# Altium schematic sheet IODevices.SchDoc: z80 Single Board Computer: I/O Devices
size A4; Author: Naoki Pross; DrawnBy: Naoki Pross; DocumentNumber: 3; SheetNumber: 2; SheetTotal: 4
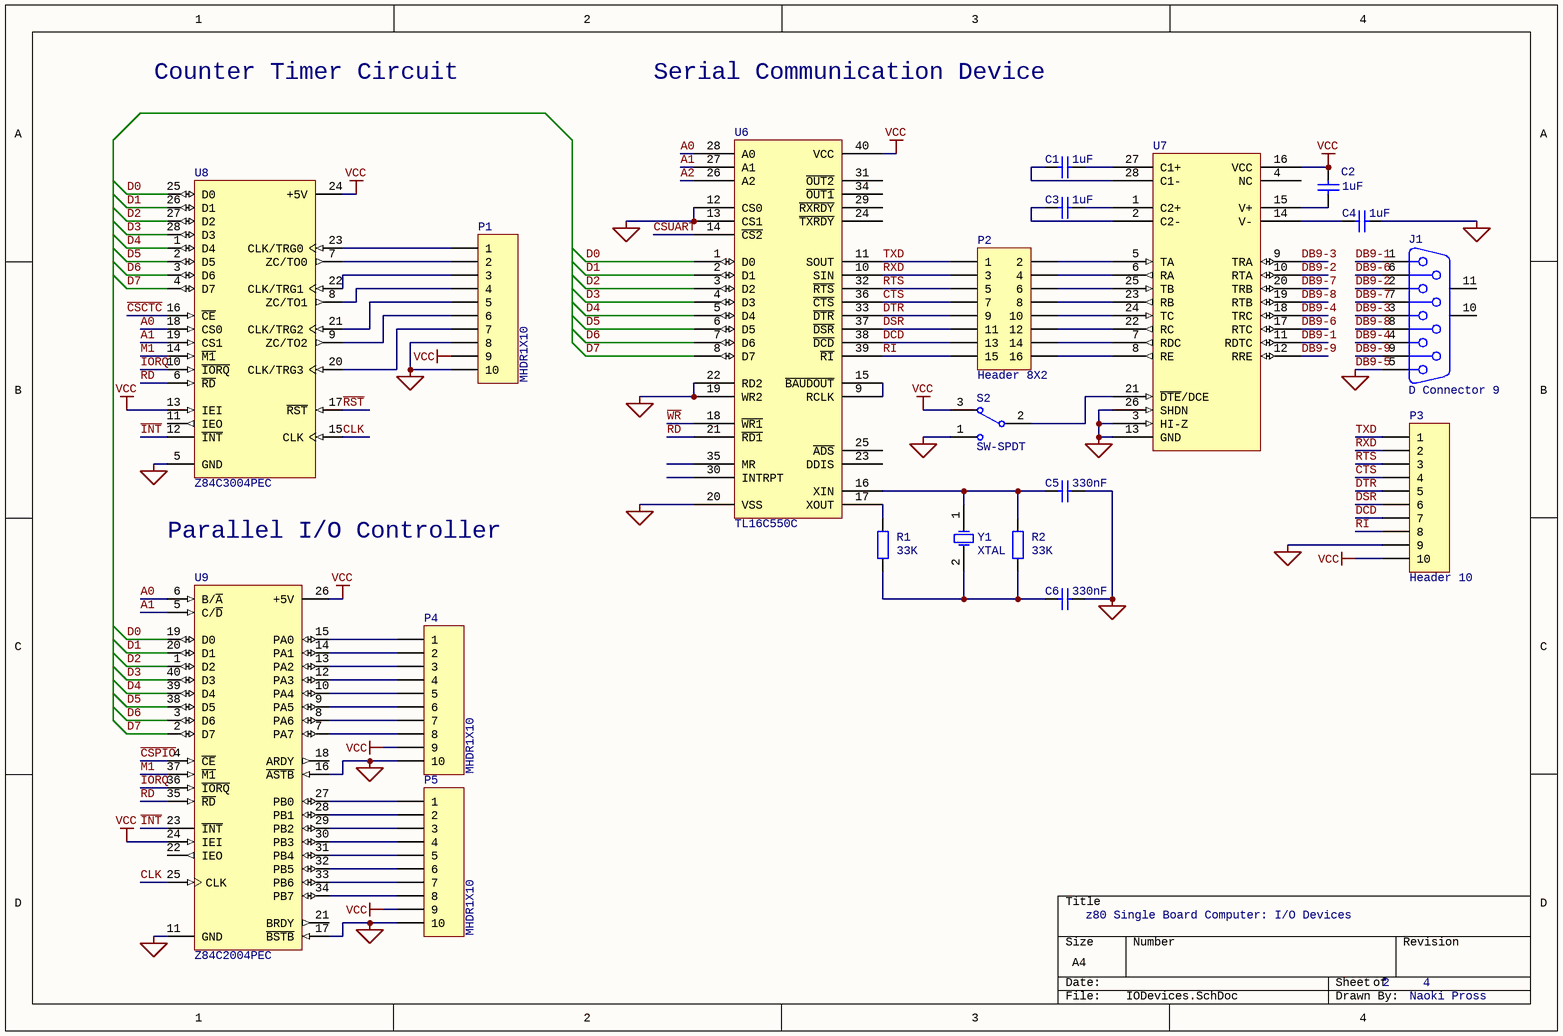
[diagram p0: IODevices.SchDoc]

## Parts
C1  value 1uF  [RAD-0.3]  (hidden comment: Cap)
C2  value 1uF  [RAD-0.3]  (hidden comment: Cap)
C3  value 1uF  [RAD-0.3]  (hidden comment: Cap)
C4  value 1uF  [RAD-0.3]  (hidden comment: Cap)
C5  value 330nF  [RAD-0.3]  (hidden comment: Cap)
C6  value 330nF  [RAD-0.3]  (hidden comment: Cap)
J1  D Connector 9  [DSUB1.385-2H9]
P1  MHDR1X10  [MHDR2X5]
P2  Header 8X2  [HDR2X8]
P3  Header 10  [MHDR2X5]
P4  MHDR1X10  [MHDR2X5]
P5  MHDR1X10  [MHDR2X5]
R1  value 33K  [AXIAL-0.4]  (hidden comment: Res2)
R2  value 33K  [AXIAL-0.4]  (hidden comment: Res2)
S2  SW-SPDT  [TL36WW15050]
U6  TL16C550C
U7  MAX214  (value not drawn)
U8  Z84C3004PEC  [PDIP28]
U9  Z84C2004PEC  [PDIP40]
Y1  XTAL  [R38]

## Nets
DB9-5: C4.2 C5.2 C6.2 J1.5 P1.8 P1.10 P3.9 P4.10 P5.10 S2.1 U6.12(CS0) U6.13(CS1) U6.19(WR2) U6.20(VSS) U6.22(RD2) U7.3(HI-Z) U7.13(GND) U7.26(SHDN) U8.5(GND) U9.11(GND) U9.16(~{ASTB}) U9.17(~{BSTB})  [also labelled GND]
VCC: C2.2 P1.9 P3.10 P4.9 P5.9 S2.3 U6.40(VCC) U7.16(VCC) U8.13(IEI) U8.24(+5V) U9.24(IEI) U9.26(+5V)
A0: U6.28(A0) U8.18(CS0) U9.6(B/~{A})
A1: U6.27(A1) U8.19(CS1) U9.5(C/~{D})
A2: U6.26(A2)
~{CSCTC}: U8.16(~{CE})
~{CSPIO}: U9.4(~{CE})
~{CSUART}: U6.14(~{CS2})
~{CTS}: P2.7 P3.4 U6.36(~{CTS})
CLK: U8.15(CLK) U9.25(CLK)
D0: U6.1(D0) U8.25(D0) U9.19(D0)
D1: U6.2(D1) U8.26(D1) U9.20(D1)
D2: U6.3(D2) U8.27(D2) U9.1(D2)
D3: U6.4(D3) U8.28(D3) U9.40(D3)
D4: U6.5(D4) U8.1(D4) U9.39(D4)
D5: U6.6(D5) U8.2(D5) U9.38(D5)
D6: U6.7(D6) U8.3(D6) U9.3(D6)
D7: U6.8(D7) U8.4(D7) U9.2(D7)
~{DCD}: P2.13 P3.7 U6.38(~{DCD})
~{DSR}: P2.11 P3.6 U6.37(~{DSR})
~{DTR}: P2.9 P3.5 U6.33(~{DTR})
DB9-1: J1.1 U7.11(RDTC)
DB9-2: J1.2 U7.10(RTA)
DB9-3: J1.3 U7.9(TRA)
DB9-4: J1.4 U7.18(TRC)
DB9-6: J1.6 U7.17(RTC)
DB9-7: J1.7 U7.20(TRB)
DB9-8: J1.8 U7.19(RTB)
DB9-9: J1.9 U7.12(RRE)
~{INT}: U8.12(~{INT}) U9.23(~{INT})
~{IORQ}: U8.10(~{IORQ}) U9.36(~{IORQ})
~{M1}: U8.14(~{M1}) U9.37(~{M1})
~{RD}: U6.21(~{RD1}) U8.6(~{RD}) U9.35(~{RD})
~{RI}: P2.15 P3.8 U6.39(~{RI})
~{RST}: U8.17(~{RST})
~{RTS}: P2.5 P3.3 U6.32(~{RTS})
RXD: P2.3 P3.2 U6.10(SIN)
TXD: P2.1 P3.1 U6.11(SOUT)
~{WR}: U6.18(~{WR1})
NetC1_1: C1.1 U7.28(C1-)
NetC1_2: C1.2 U7.27(C1+)
NetC2_1: C2.1 U7.15(V+)
NetC3_1: C3.1 U7.2(C2-)
NetC3_2: C3.2 U7.1(C2+)
NetC4_1: C4.1 U7.14(V-)
NetC5_1: C5.1 R2.2 U6.16(XIN) Y1.1(OSC1)
NetC6_1: C6.1 R1.1 R2.1 Y1.2(OSC2)
NetP1_1: P1.1 U8.23(CLK/TRG0)
NetP1_2: P1.2 U8.7(ZC/TO0)
NetP1_3: P1.3 U8.22(CLK/TRG1)
NetP1_4: P1.4 U8.8(ZC/TO1)
NetP1_5: P1.5 U8.21(CLK/TRG2)
NetP1_6: P1.6 U8.9(ZC/TO2)
NetP1_7: P1.7 U8.20(CLK/TRG3)
NetP2_2: P2.2 U7.5(TA)
NetP2_4: P2.4 U7.6(RA)
NetP2_6: P2.6 U7.25(TB)
NetP2_8: P2.8 U7.23(RB)
NetP2_10: P2.10 U7.24(TC)
NetP2_12: P2.12 U7.22(RC)
NetP2_14: P2.14 U7.7(RDC)
NetP2_16: P2.16 U7.8(RE)
NetP4_1: P4.1 U9.15(PA0)
NetP4_2: P4.2 U9.14(PA1)
NetP4_3: P4.3 U9.13(PA2)
NetP4_4: P4.4 U9.12(PA3)
NetP4_5: P4.5 U9.10(PA4)
NetP4_6: P4.6 U9.9(PA5)
NetP4_7: P4.7 U9.8(PA6)
NetP4_8: P4.8 U9.7(PA7)
NetP5_1: P5.1 U9.27(PB0)
NetP5_2: P5.2 U9.28(PB1)
NetP5_3: P5.3 U9.29(PB2)
NetP5_4: P5.4 U9.30(PB3)
NetP5_5: P5.5 U9.31(PB4)
NetP5_6: P5.6 U9.32(PB5)
NetP5_7: P5.7 U9.33(PB6)
NetP5_8: P5.8 U9.34(PB7)
NetR1_2: R1.2 U6.17(XOUT)
NetS2_2: S2.2 U7.21(~{DTE}/DCE)
NetU6_9: U6.9(RCLK) U6.15(~{BAUDOUT})

Not connected (* = marked no-connect by the designer): J1 10(MH1) 11(MH2); U6 23(DDIS) 24(~{TXRDY}) 25(~{ADS}) 29(~{RXRDY}) 30(INTRPT) 31(~{OUT2}) 34(~{OUT1}) 35(MR); U7 4(NC); U8 11(IEO); U9 18(ARDY) 21(BRDY) 22(IEO)

## Notes on the sheet
- Counter Timer Circuit
- Serial Communication Device
- Parallel I/O Controller

## Library data of the parts
C1-C6 = Cap: Capacitor; Published: 8-Jun-2000; LatestRevisionDate: 17-Jul-2002; LatestRevisionNote: Re-released for DXP Platform.; PackageReference: RAD-0.3; Publisher: Altium Limited; PackageDescription: Radial Cap, Thru-Hole; 2 Leads; 0.3 in Pin Spacing
J1 = D Connector 9: Receptacle Assembly, 9 Position, Right Angle; PackageDocument: O; Positions: 9; Published: 15-Jun-2001; LatestRevisionDate: 17-Jul-2002; LatestRevisionNote: Re-released for DXP Platform.; DatasheetDocument: 1-Sep-1999; PackageReference: 788750; Publisher: Altium Limited; Orientation: Right Angle; Gender: Receptacle
P1 P4 P5 = MHDR1X10: Header, 10-Pin; LatestRevisionDate: 17-Jul-2002; LatestRevisionNote: Re-released for DXP Platform.; Publisher: Altium Limited
P2 = Header 8X2: Header, 8-Pin, Dual row; LatestRevisionDate: 17-Jul-2002; LatestRevisionNote: Re-released for DXP Platform.; Publisher: Altium Limited
P3 = Header 10: Header, 10-Pin; LatestRevisionDate: 17-Jul-2002; LatestRevisionNote: Re-released for DXP Platform.; Publisher: Altium Limited
R1 R2 = Res2: Resistor; Published: 8-Jun-2000; LatestRevisionDate: 17-Jul-2002; LatestRevisionNote: Re-released for DXP Platform.; PackageReference: AXIAL-0.4; Publisher: Altium Limited; PackageDescription: Axial Device, Thru-Hole; 2 Leads; 0.4 in Pin Spacing
S2 = SW-SPDT: SPDT Subminiature Toggle Switch, Right Angle Mounting, Vertical Actuation; Published: 24-Mar-1999; LatestRevisionDate: 17-Dec-2003; LatestRevisionNote: Schematic revised, PCB Footprint replaced.; DatasheetVersion: 05-Dec-2000; PackageReference: TL36WW15050; Publisher: Altium Limited; PackageDescription: Switch; 4 Leads; ComponentLink1Description: Manufacturer Link; ComponentLink1URL: http://www.apem.com
U8 = Z84C3004PEC: CMOS Four-Channel Counter/Timer Circuit; Note: Pin(s) 28 "No Connection" and not drawn.; Published: 15-Apr-2002; LatestRevisionDate: 04-Mar-2005; LatestRevisionNote: Stylized 3D Model Added.; DatasheetVersion: 2001; PackageVersion: 2001; PackageReference: PDIP28; Publisher: Altium Limited; PackageDescription: DIP; 28 Leads; Row Spacing 15.24 mm; Pitch 2.54 mm; ComponentLink1Description: Manufacturer Link; ComponentLink1URL: http://www.zilog.com/; ComponentLink2Description: Datasheet; ComponentLink2URL: http://www.zilog.com/docs/z80/um0081.pdf
U9 = Z84C2004PEC: CMOS Parallel I/O Controller; Published: 15-Apr-2002; LatestRevisionDate: 04-Mar-2005; LatestRevisionNote: Stylized 3D Model Added.; DatasheetVersion: 2001; PackageVersion: Jun-1999; PackageReference: PDIP40; Publisher: Altium Limited; PackageDescription: DIP; 40 Leads; Row Spacing 15.24 mm; Pitch 2.54 mm; ComponentLink1Description: Manufacturer Link; ComponentLink1URL: http://www.zilog.com/; ComponentLink2Description: Datasheet; ComponentLink2URL: http://www.zilog.com/docs/z80/um0081.pdf
Y1 = XTAL: Crystal Oscillator; Published: 8-Jun-2000; LatestRevisionDate: 17-Jul-2002; LatestRevisionNote: Re-released for DXP Platform.; PackageReference: R38; Publisher: Altium Limited; PackageDescription: Crystal, Thru-Hole; 2 Leads; Body 3.1 x 8.2 mm (Dia.xH)